# Altium schematic sheet MPPT.SchDoc
size A4; SheetNumber: 3; SheetTotal: 3
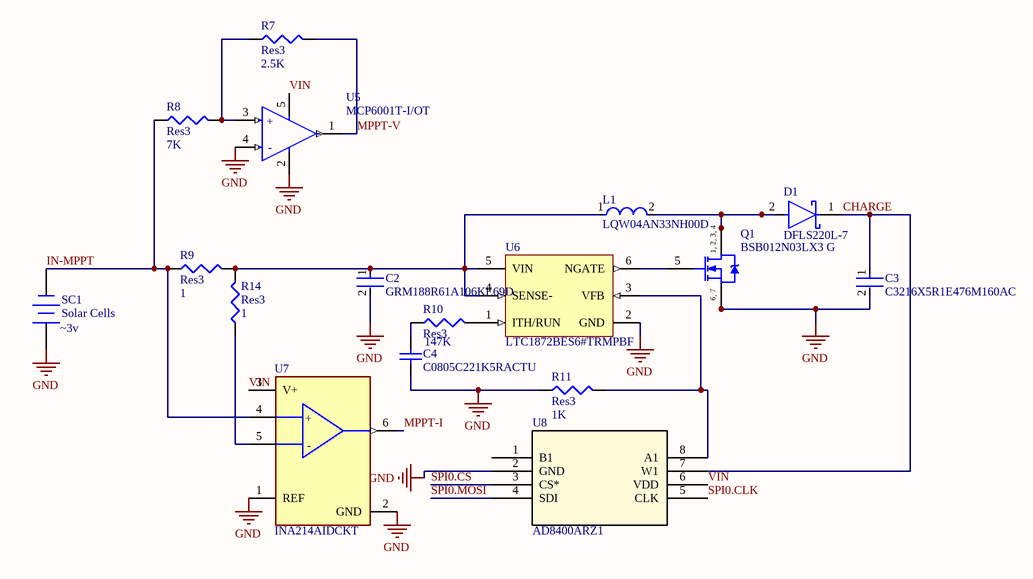
[diagram p0: MPPT.SchDoc]

## Parts
C2  GRM188R61A106KE69D  [FP-GRM18-0_15-MFG]
C3  C3216X5R1E476M160AC  [FP-C3216-160-MFG]
C4  C0805C221K5RACTU  [CAPC2013X88X50LL20T25]
D1  DFLS220L-7  [FP-PowerDI123-MFG]
L1  LQW04AN33NH00D  [FP-LQW04AN_00-MFG]
Q1  BSB012N03LX3 G  [INF-MG-WDSON-2-8_V]
R7  Res3  value 2.5K  [J1-0603]
R8  Res3  value 7K  [J1-0603]
R9  Res3  value 1  [J1-0603]
R10  Res3  value 147K  [J1-0603]
R11  Res3  value 1K  [J1-0603]
R14  Res3  value 1  [J1-0603]
SC1  Solar Cells  [BAT-2]
U5  MCP6001T-I/OT  [FP-C04-091-OT-IPC_A]
U6  LTC1872BES6#TRMPBF  [LT-S6-6-TSOT-23_L]
U7  INA214AIDCKT  [FP-DCK0006A-MFG]
U8  AD8400ARZ1  [R_8_ADI]

## Nets
GND: C2.2 C3.2 C4.1 Q1.6(SOURCE) Q1.7(SOURCE) R11.1 SC1.1(+) U5.2(VSS) U5.4(VIN-) U6.2(GND) U7.1(REF) U7.2(GND) U8.2(GND)
CHARGE: C3.1 D1.1(C) U8.7(W1)
IN-MPPT: R8.1 R9.1 SC1.2(-) U7.4(IN+)
MPPT-I: U7.6(OUT)
MPPT-V: R7.2 U5.1(VOUT)
SPI0.CLK: U8.5(CLK)
SPI0.CS: U8.3(CS*)
SPI0.MOSI: U8.4(SDI)
VIN: U5.5(VDD) U7.3(V+) U8.6(VDD)
NetC2_1: C2.1 L1.1 R9.2 R14.2 U6.4(SENSE-) U6.5(VIN)
NetC4_2: C4.2 R10.1
NetD1_2: D1.2(A) L1.2 Q1.1(DRAIN) Q1.2(DRAIN) Q1.3(DRAIN) Q1.4(DRAIN)
NetQ1_5: Q1.5(GATE) U6.6(NGATE)
NetR7_1: R7.1 R8.2 U5.3(VIN+)
NetR10_2: R10.2 U6.1(ITH/RUN)
NetR11_2: R11.2 U6.3(VFB) U8.8(A1)
NetR14_1: R14.1 U7.5(IN-)

Not connected (* = marked no-connect by the designer): U8 1(B1)

## Notes on the sheet
- (near SC1) ~3v
- (in symbol CMP-0187-00462-3) +; -
- (in symbol CMP-1090-00012-1) 1, 2, 3, 4; 6, 7
- (in symbol CMP-2000-06456-2) +; -

## Library data of the parts
C2 = CMP-2000-05448-2: CAP CER 10UF 10V X5R 0603; Manufacturer: Murata; Temperature Coefficient: 15%; Material: Ceramic; Tolerance: 10%; Device Class L1: Passive Components; ComponentLink2Description: Datasheet; Height: 0.95mm; Package: GRM18-0.15; Octopart: https://octopart.com/grm188r61a106ke69d-murata-22851381; Manufacturer Part Number: GRM188R61A106KE69D; Value: 10uF; Digikey Description: CAP CER 10UF 10V X5R 0603; Temperature Range High: +85°C; Temperature Range Low: -55°C; Temperature Characteristic: X5R; Capacitance: 10uF; RoHS: TRUE; Device Class L2: Capacitors; ComponentLink2URL: https://search.murata.co.jp/Ceramy/image/img/A01X/G101/ENG/GRM188R61A106KE69-01A.pdf; Device Class L3: Ceramic Capacitors; Lead Free: Yes; Mouser Description: Multilayer Ceramic Capacitors MLCC - SMD/SMT 0603 10uF 10volts X5R + - 10%; Category: Cap; Voltage Rating: 10V; Temperature: -55°C to +85°C; Automotive: No
C3 = CMP-2000-05397-2: CAP CER 47UF 25V X5R 1206; 3DS Part Number: 220-00004; Manufacturer: TDK; Temperature Coefficient: 15%; Tolerance: 20%; Material: Ceramic; Height: 1.8mm; Device Class L1: Passive Components; Temperature Characteristic: X5R; Voltage: 25V; Digikey Description: CAP CER 47UF 25V X5R 1206; Voltage Rating: 25V; ComponentLink2URL: https://product.tdk.com/info/en/catalog/datasheets/mlcc_commercial_general_en.pdf; Category: Cap; Capacitance: 47uF; Ipc Land Pattern Name: CAPC320160X160; Temperature Range High: +85°C; ComponentLink2Description: Datasheet; Temperature: -55°C to +85°C; Mouser Description: Multilayer Ceramic Capacitors MLCC - SMD/SMT 1206 47uF 25volts X5R 20%; Lead Free: Yes; RoHS: TRUE; Device Class L2: Capacitors; Device Class L3: Ceramic Capacitors; Manufacturer Part Number: C3216X5R1E476M160AC; Automotive: No; Temperature Range Low: -55°C; Footprint Url: https://product.tdk.com/info/en/catalog/spec/mlccspec_commercial_general_midvoltage_en.pdf; Value: 47uF; Octopart: https://octopart.com/c3216x5r1e476m160ac-tdk-25947783; Package: C3216-160
C4 = CMP-2007-00321-1: Manufacturer: Kemet; Part Number: C0805C221K5RACTU
D1 = CMP-12790-000030-1: DIODE SCHOTTKY 20V 2A POWERDI123; Manufacturer: Diodes Inc.; Capacitance: 75pF; Max Junction Temp: +125°C; Max Surge Forward Current: 40A; Peak Reverse Current: 1mA; Value: 75pF; Package: PowerDI123; Temperature: -55°C to +125°C; ComponentLink2Description: Datasheet; RoHS: TRUE; Category: Diode; Digikey Description: DIODE SCHOTTKY 20V 2A POWERDI123; Temperature Range Low: -55°C; Mouser Description: DFLS220L Series 20 V 2 A Surface Mount Schottky Barrier Rectifier - PowerDI-123; Device Class L3: Schottky Diodes; Device Class L2: Diodes; Device Class L1: Discrete Semiconductors; Manufacturer Part Number: DFLS220L-7; Reverse Voltage: 20V; Max Repetitive Reverse Voltage: 20V; Octopart: https://octopart.com/dfls220l-7-diodes+inc.-328575; Temperature Range High: +125°C; Automotive: No; Forward Current: 2A; Footprint Url: https://www.diodes.com/assets/Package-Files/PowerDI123.pdf; Lead Free: Yes; ComponentLink2URL: https://www.diodes.com/assets/Datasheets/ds30517.pdf; Height: 1mm
L1 = CMP-06042-000403-1: Wire Wound RF Inductor 33nH ±3% 140mA 1.11Ω 03015 (0804); Q Factor: 15; Test Frequency: 100MHz; Self Resonant Frequency: 4GHz; DC Resistance (DCR): 1.11R; Shielding: Unshielded; Core Material: Ferrite; Case Code (Metric): 0804; Tolerance: 3%; Military Standard: Not; Current Rating: 140mA; Max DC Current: 140mA; Case Code (Imperial): 3015; Termination: SMD/SMT; Depth: 0.45mm; Package Quantity: 10000; DC Current: 140mA; Min Operating Temperature: -55°C; Case/Package: Nonstandard; Packaging: Tape and Reel; Mount: Surface Mount; Max Operating Temperature: 125°C; Lead Free: Lead Free; Height - Seated (Max): 0.018inch; Weight: 1.1E-05oz; Height: 0.4mm; Length: 0.8mm; Width: 0.016inch; Inductance: 33nH
Q1 = CMP-1090-00012-1: N-Channel OptiMOS 3 Power-MOSFET, 30 V VDS, 180 A ID, -40 to 150 degC, MG-WDSON-2-8, Reel, Green; Manufacturer: Infineon; Rth: 1.4Â K/W; VGS(th) (min): 1Â V; IDpuls (max): 400Â A; Ptot (max): 89Â W; RthJA (max): 45 K/W; RDS (on) (max): 1.2Â mOhm; RthJC (max): 1.4 K/W; VDS (max): 30Â V; QG: 127Â nC; ID (max): 180Â A; RDS (on) (max) (@4.5V): 1.8Â mOhm; Polarity: N; Green: TRUE; VGS(th) (max): 2.2Â V; ComponentLink2URL: http://www.infineon.com/dgdl/BSB012N03LX3+G_Rev_+2.1_pdf.pdf?folderId=db3a304313b8b5a60113cee8763b02d7&fileId=db3a304320d39d590121a0112ce07a8b; PackageVersion: Jun-09; ComponentLink3URL: http://www.infineon.com/dgdl/MG-WDSON-2-MX-Package_Overview.pdf?folderId=db3a30431f848401011fb8316d98599f&fileId=db3a30431f848401011fb8a9e1645a0a; ComponentLink1URL: http://www.infineon.com/; PackageReference: MG-WDSON-2-8; PackageDescription: 7-Pin Metal Green Very Very Thin Profile Dual Small Outline Non-leaded Package; Halogen-free: TRUE; Packing: Reel; ComponentLink3Description: Package Specification; DatasheetVersion: Rev. 2.1; PartNumber: BSB012N03LX3 G; Mounting Technology: Surface Mount; ComponentLink1Description: Manufacturer URL; ComponentLink2Description: Datasheet
R7-R11 R14 = Res3: Resistor; Published: 8-Jun-2000; LatestRevisionDate: 29-May-2009; LatestRevisionNote: IPC-7351 Footprint Added.; PackageReference: J1-0603; Publisher: Altium Limited; PackageDescription: Chip Resistor
SC1 = Battery: Multicell Battery; Published: 24-Mar-1999; LatestRevisionDate: 17-Jul-2002; LatestRevisionNote: Re-released for DXP Platform.; PackageReference: BAT-2; Publisher: Altium Limited; PackageDescription: Battery; 2 Leads
U5 = CMP-0187-00462-3: IC OPAMP GP 1 CIRCUIT SOT23-5; Number of Amplifiers: 1; Voltage: 6V; Power Supply Rejection Ratio (PSRR): 86dB; Common Mode Rejection Ratio: 60dB; Unity Gain Bandwidth Product: 1MHz; Slew Rate: 0.6V/µs; Output Current per Channel: 23mA; Nominal Supply Current: 100uA; Input Offset Voltage (Vos): 4.5mV; Input Bias Current: 1pA; Operating Supply Voltage: 5.5V; Min Supply Voltage: 1.8V; Voltage Gain: 112dB; Length: 3.1mm; REACH SVHC: No SVHC; Number of Pins: 5; Package Quantity: 1; Radiation Hardening: No; Mount: Surface Mount; Number of Circuits: 1; Number of Elements: 1; Output Current: 23mA; Packaging: Tape and Reel; Height: 1.3mm; Lead Free: Lead Free; Min Operating Temperature: -40°C; Bandwidth: 1MHz; Contact Plating: Tin; Max Supply Voltage: 6V; Max Operating Temperature: 85°C; Width: 1.8mm; Case/Package: SOT-23; Operating Supply Current: 100uA; Number of Channels: 1; Gain Bandwidth Product: 1MHz
U6 = CMP-0492-01790-1: Constant Frequency Current Mode Step-Up DC/DC Controller, 6-pin SOT23 (S6-6), -40 to 85 degC, Pb-Free, Mini Tape and Reel; Manufacturer: Linear Technology; Number of Outputs: 1; RoHS: TRUE; PackageReference: S6-6; ComponentLink2URL: http://cds.linear.com/docs/en/datasheet/1872bf.pdf; Packing: Mini Tape and Reel; Mounting Technology: Surface Mount; Code_JEDEC: MO-193; ComponentLink1URL: http://www.linear.com/; ComponentLink3Description: Package Specification; PackageDescription: 6-Pin Plastic TSOT-23, Body 2.9 x 1.63 mm, Pitch 0.95 mm; PartNumber: LTC1872BES6#TRMPBF; ComponentLink2Description: Datasheet; PackageVersion: Jun-10; ComponentLink3URL: http://cds.linear.com/docs/en/packaging/SOT_6_05-08-1636.pdf; ComponentLink1Description: Manufacturer URL
U7 = CMP-2000-06456-2: IC CURR SENSE 1 CIRCUIT SC70-6; Manufacturer: Texas Instruments; Voltage Gain: 0.1V/mV; Max Supply Voltage: 26V; Bandwidth: 30kHz; Number Of Channels: 1; Min Supply Voltage: 2.7V; Nominal Supply Current: 65uA; Max Junction Temp: +150°C; Input Offset Voltage: 0.001mV; Standoff Height: 0mm; Input Bias Current: 28uA; Device Class L1: Integrated Circuits (ICs); Device Class L2: Linear ICs; Height: 1.1mm; Temperature Range High: +125°C; Package: DCK0006A; RoHS: TRUE; Temperature: -40°C to +125°C; Automotive: No; Manufacturer Part Number: INA214AIDCKT; Device Class L3: Instrumentation; Mouser Description: Current Sense Amplifiers Hi/Lo-Side Bi-Dir 0- Drift Ser Crnt Shunt; Digikey Description: IC CURR SENSE 1 CIRCUIT SC70-6; ComponentLink2Description: Datasheet; Lead Free: Yes; Ambient Temperature Range High: +125°C; Temperature Range Low: -40°C; ComponentLink2URL: http://www.ti.com/lit/ds/symlink/ina214.pdf; Octopart: https://octopart.com/ina214aidckt-texas+instruments-7830703; Ambient Temperature Range Low: -40°C; Category: IC
U8 = AD8400ARZ1: No Description Available; SourceLibrary: Analog_2012-01-01_5; Built_By: EMA_UL_Team; Vendor: Analog Devices Inc; Manufacturer_Part_Number: AD8400ARZ1; Copyright: Copyright (C) 2018 Accelerated Designs. All rights reserved; RefDes: RefDes; Type: DEV